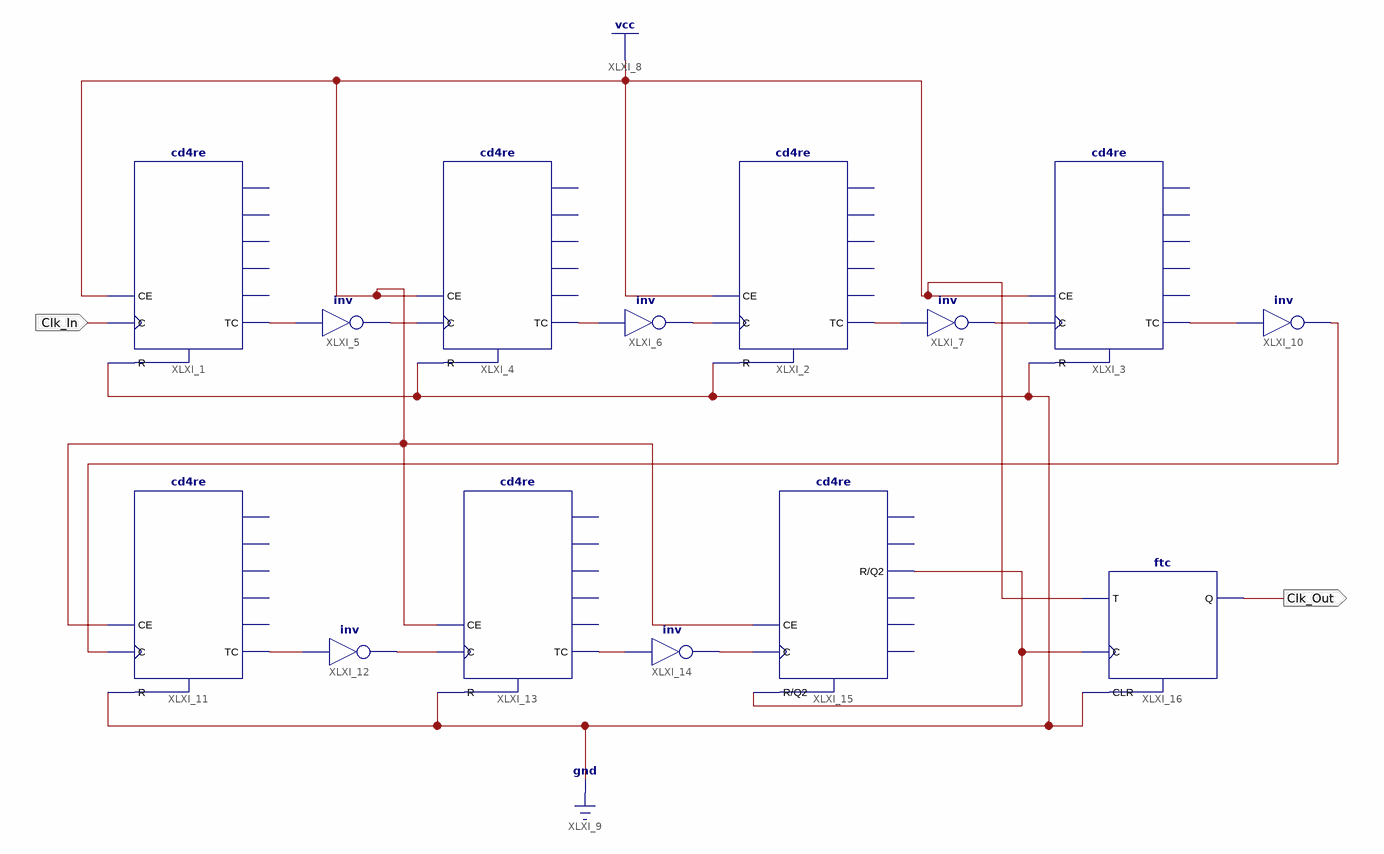
[diagram p0: schematic sheet 1]
// Xilinx ISE schematic DividerForNumber.sch (spartan6) as structural Verilog: 14 symbols, 2 ports
module DividerForNumber (
  input  Clk_In,
  output Clk_Out
);

  wire XLXN_1, XLXN_2, XLXN_3, XLXN_4, XLXN_5, XLXN_6, XLXN_7, XLXN_8, XLXN_9, XLXN_10, XLXN_13, XLXN_15,
       XLXN_31;

  cd4re XLXI_1 (.C(Clk_In), .CE(1'b1), .R(1'b0), .TC(XLXN_9));  // open: CEO, Q0, Q1, Q2, Q3
  cd4re XLXI_2 (.C(XLXN_8), .CE(1'b1), .R(1'b0), .TC(XLXN_5));  // open: CEO, Q0, Q1, Q2, Q3
  cd4re XLXI_3 (.C(XLXN_6), .CE(1'b1), .R(1'b0), .TC(XLXN_13));  // open: CEO, Q0, Q1, Q2, Q3
  cd4re XLXI_4 (.C(XLXN_10), .CE(1'b1), .R(1'b0), .TC(XLXN_7));  // open: CEO, Q0, Q1, Q2, Q3
  not XLXI_5 (XLXN_10, XLXN_9);
  not XLXI_6 (XLXN_8, XLXN_7);
  not XLXI_7 (XLXN_6, XLXN_5);
  not XLXI_10 (XLXN_15, XLXN_13);
  cd4re XLXI_11 (.C(XLXN_15), .CE(1'b1), .R(1'b0), .TC(XLXN_1));  // open: CEO, Q0, Q1, Q2, Q3
  not XLXI_12 (XLXN_2, XLXN_1);
  cd4re XLXI_13 (.C(XLXN_2), .CE(1'b1), .R(1'b0), .TC(XLXN_3));  // open: CEO, Q0, Q1, Q2, Q3
  not XLXI_14 (XLXN_4, XLXN_3);
  cd4re XLXI_15 (.C(XLXN_4), .CE(1'b1), .R(XLXN_31), .Q2(XLXN_31));  // open: CEO, Q0, Q1, Q3, TC
  ftc XLXI_16 (.C(XLXN_31), .CLR(1'b0), .T(1'b1), .Q(Clk_Out));
endmodule
